# Altium schematic sheet 00_Index.SchDoc
size A4; Author: Ganghyeok Lim; Revision: B; SheetNumber: 1; SheetTotal: 7
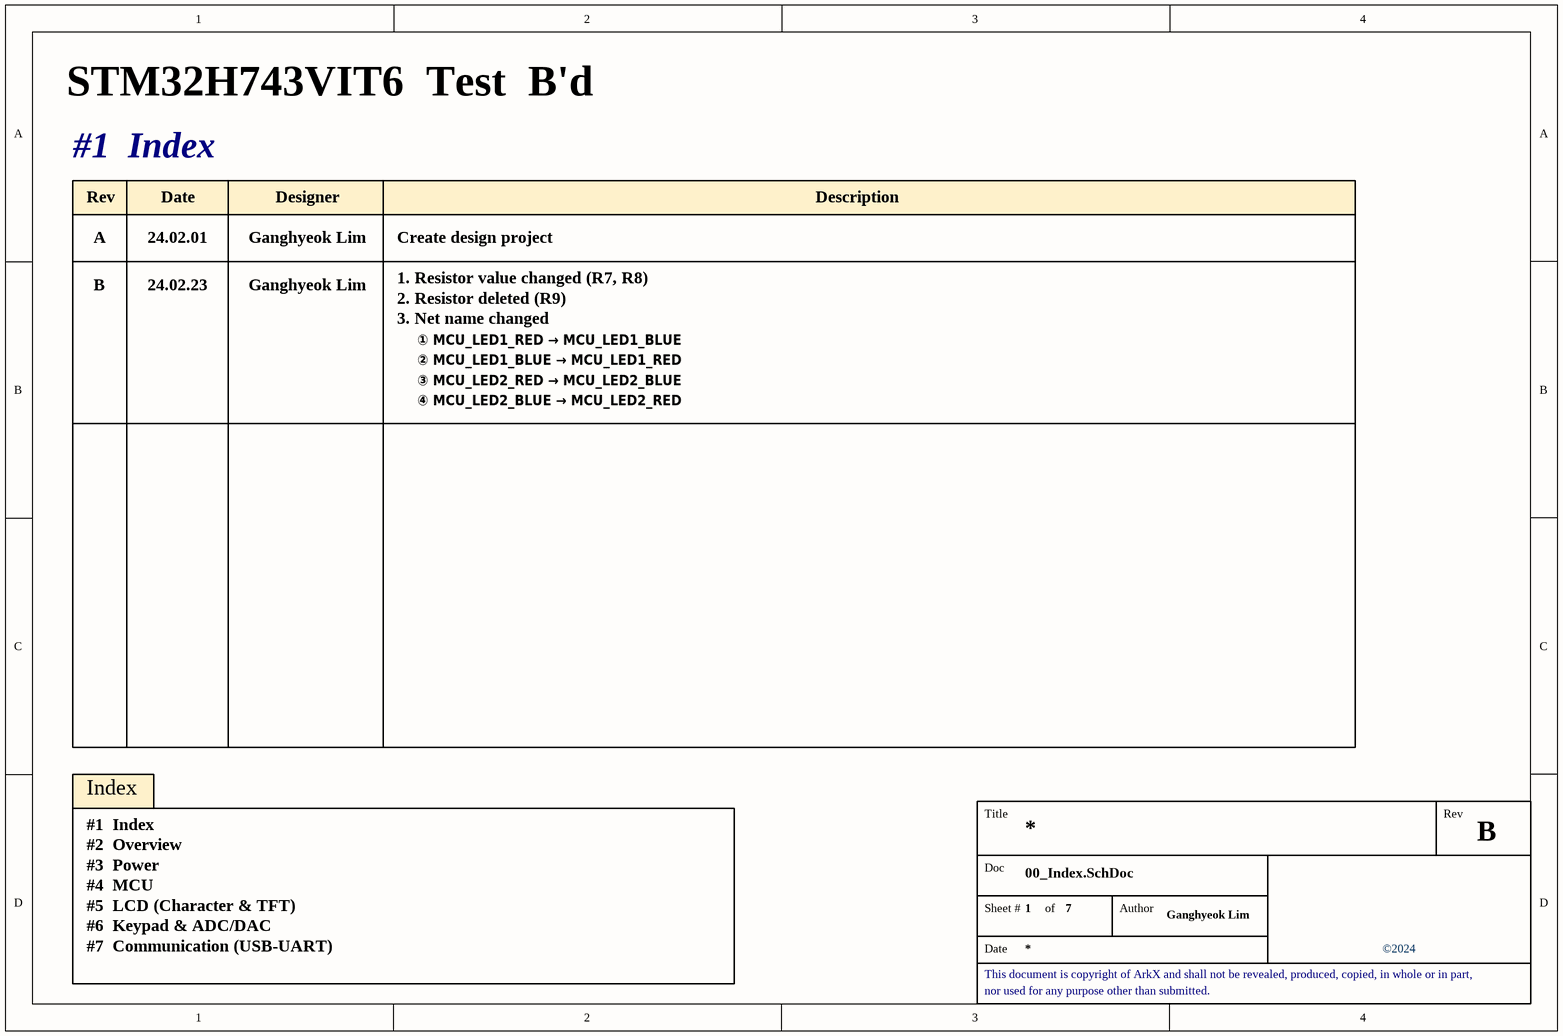
[diagram p0: 00_Index.SchDoc]

## Notes on the sheet
- STM32H743VIT6  Test  B'd
- #1  Index
- Rev
- A
- 24.02.01
- Date
- Ganghyeok Lim
- Designer
- Create design project
- Description
- B
- 24.02.23
- 1. Resistor value changed (R7, R8)
- 2. Resistor deleted (R9)
- 3. Net name changed
- ① MCU_LED1_RED → MCU_LED1_BLUE
- ② MCU_LED1_BLUE → MCU_LED1_RED
- ③ MCU_LED2_RED → MCU_LED2_BLUE
- ④ MCU_LED2_BLUE → MCU_LED2_RED
- Index
- #2  Overview
- #3  Power
- #4  MCU
- #5  LCD (Character & TFT)
- #6  Keypad & ADC/DAC
- #7  Communication (USB-UART)
- Title
- Doc
- Sheet #
- of
- Author
- This document is copyright of ArkX and shall not be revealed, produced, copied, in whole or in part,
- ©2024
- nor used for any purpose other than submitted.